# Altium schematic sheet Battery.SchDoc
size Letter; ProjectTitle: FSAE Libraries
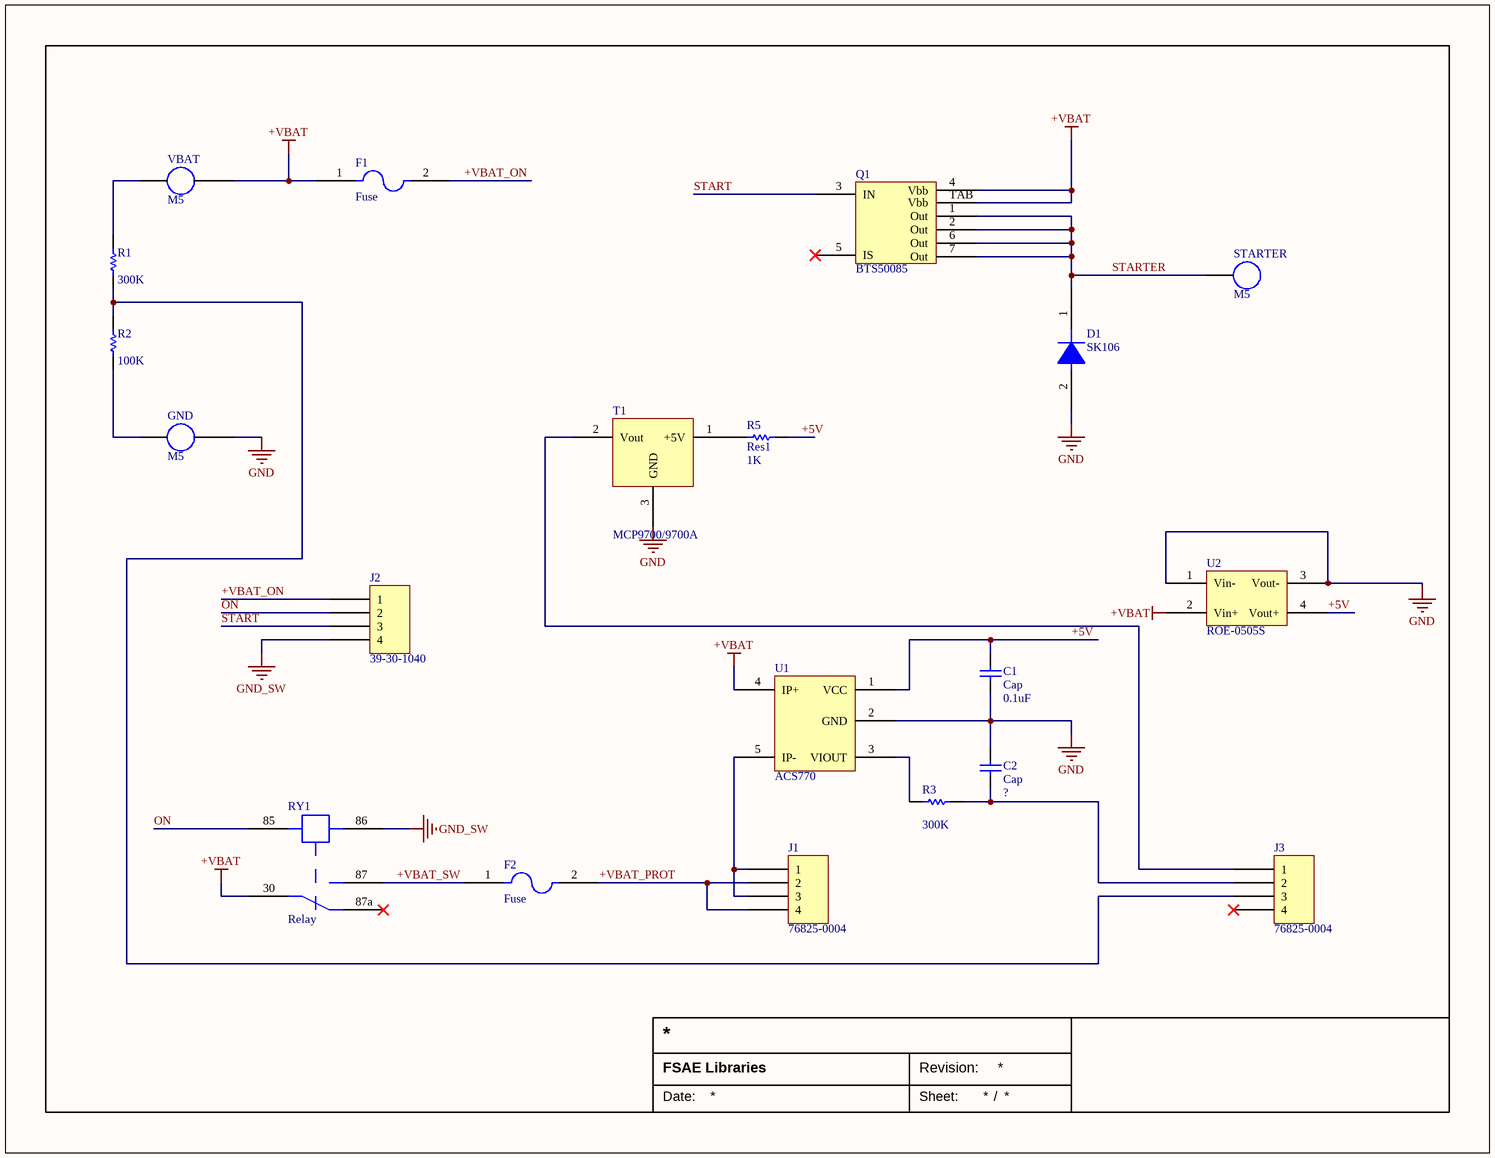
[diagram p0: Battery.SchDoc]

## Parts
C1  Cap  value 0.1uF  [RAD-0.3]
C2  Cap  [RAD-0.3]
D1  SK106  [DIOM8060X54N]
F1  Fuse  [FUSE]
F2  Fuse  [FUSE]
GND  M5  [MH-M5]
J1  76825-0004  [76825-0004]
J2  39-30-1040  [39-30-1040]
J3  76825-0004  [76825-0004]
Q1  BTS50085  [BTS50085]  (no BOM)
R1  R1: 300K  [AXIAL-0.3]
R2  value 100K  [AXIAL-0.3]
R3  R1: 300K  [AXIAL-0.3]
R5  Res1  value 1K  [AXIAL-0.3]
RY1  Relay  [Relay]
STARTER  M5  [MH-M5]
T1  MCP9700/9700A  [TempSensor]
U1  ACS770  [ACS770]  (no BOM)
U2  ROE-0505S  [ROE-0505S]  (no BOM)
VBAT  M5  [MH-M5]

## Nets
+VBAT: F1.1 Q1.4(Vbb) Q1.TAB(Vbb) RY1.30 U1.4(IP+) U2.2(Vin+)
GND: C1.2 C2.2 D1.2 T1.3(GND) U1.2(GND) U2.1(Vin-) U2.3(Vout-)
GND_SW: J2.4 RY1.86
+5V: C1.1 R5.2 U1.1(VCC) U2.4(Vout+)
+VBAT_ON: F1.2 J2.1
+VBAT_PROT: F2.2 J1.2 J1.4
+VBAT_SW: F2.1 RY1.87
ON: J2.2 RY1.85
START: J2.3 Q1.3(IN)
STARTER: D1.1 Q1.1(Out) Q1.2(Out) Q1.6(Out) Q1.7(Out) STARTER.1
NetC2_1: C2.1 J3.2 R3.1
NetGND_1: GND.1 R2.1
NetJ1_1: J1.1 J1.3 U1.5(IP-)
NetJ3_1: J3.1 T1.2(Vout)
NetJ3_3: J3.3 R1.1 R2.2
NetR1_2: R1.2 VBAT.1
NetR3_2: R3.2 U1.3(VIOUT)
NetR5_1: R5.1 T1.1(+5V)

Not connected (* = marked no-connect by the designer): GND ?1; J3 4*; Q1 5(IS)*; RY1 87a*; VBAT ?1

## Notes on the sheet
- Date:
- Revision:
- Sheet:
- /

## Library data of the parts
C1 C2 = Cap: Capacitor; Published: 8-Jun-2000; LatestRevisionDate: 17-Jul-2002; LatestRevisionNote: Re-released for DXP Platform.; PackageReference: RAD-0.3; Publisher: Altium Limited; PackageDescription: Radial Cap, Thru-Hole; 2 Leads; 0.3 in Pin Spacing
  C2: Value: ?
GND STARTER VBAT = MH-M5: M5 mounting hole
J3 = 76825-0004: J3
R1-R3 R5 = Res1: Resistor; Published: 8-Jun-2000; LatestRevisionDate: 17-Jul-2002; LatestRevisionNote: Re-released for DXP Platform.; PackageReference: AXIAL-0.3; Publisher: Altium Limited; PackageDescription: Axial Device, Thru-Hole; 2 Leads; 0.3 in Pin Spacing
T1 = MCP9700/9700A: Temp Sensor